# Altium project RTDMeasurement.PrjPcb (part 2 of 2)

## Sheet 12VSupply.SchDoc
size A
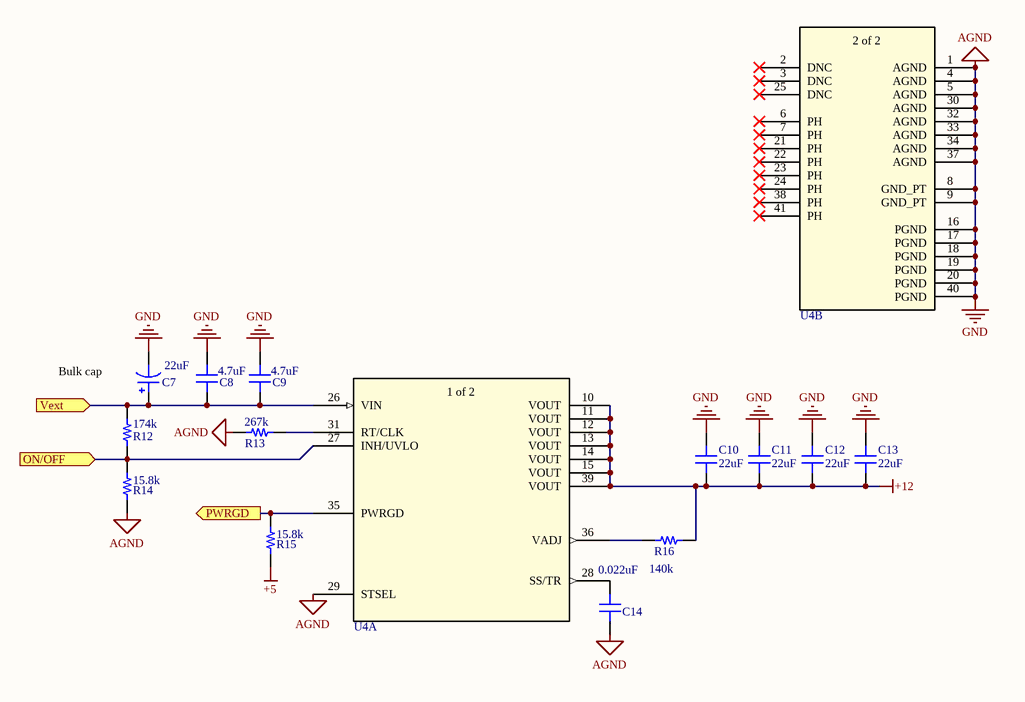
[diagram p9: 12VSupply.SchDoc]

### Parts
C7  22uF  [CAP AL TH D8 L3.5 H11.5]
C8  4.7uF  [CAP 1206/3216 - 1.0MM]
C9  4.7uF  [CAP 1206/3216 - 1.0MM]
C10  22uF  [CAP 1206/3216]
C11  22uF  [CAP 1206/3216]
C12  22uF  [CAP 1206/3216]
C13  22uF  [CAP 1206/3216]
C14  0.022uF  [CAP 0805/2012]
R12  174k  [RES 0805/2012]
R13  267k  [RES 1206/3216]
R14  15.8k  [RES 0805/2012]
R15  15.8k  [RES 0805/2012]
R16  140k  [RES 0805/2012]
U4  LMZ35003RKGR  [RKG41]  (value not drawn)  (parts A,B of 2)

### Ports
ON/OFF (in), PWRGD (out), Vext (in)

### Nets
+5: R15.1
+12: C10.2 C11.2 C12.2 C13.2 R16.2 U4.10(VOUT) U4.11(VOUT) U4.12(VOUT) U4.13(VOUT) U4.14(VOUT) U4.15(VOUT) U4.39(VOUT)
GND: C7.2 C8.2 C9.2 C10.1 C11.1 C12.1 C13.1 C14.1 R13.1 R14.1 U4.1(AGND) U4.4(AGND) U4.5(AGND) U4.8(GND_PT) U4.9(GND_PT) U4.16(PGND) U4.17(PGND) U4.18(PGND) U4.19(PGND) U4.20(PGND) U4.29(STSEL) U4.30(AGND) U4.32(AGND) U4.33(AGND) U4.34(AGND) U4.37(AGND) U4.40(PGND)  [also labelled AGND]
ON/OFF: R12.1 R14.2 U4.27(INH/UVLO) ; port ON/OFF
Vext: C7.1 C8.1 C9.1 R12.2 U4.26(VIN) ; port Vext
NetC14_2: C14.2 U4.28(SS/TR)
NetR13_2: R13.2 U4.31(RT/CLK)
NetR15_2: R15.2 U4.35(PWRGD) ; port PWRGD
NetR16_1: R16.1 U4.36(VADJ)

Not connected (* = marked no-connect by the designer): U4 2(DNC)* 3(DNC)* 6(PH)* 7(PH)* 21(PH)* 22(PH)* 23(PH)* 24(PH)* 25(DNC)* 38(PH)* 41(PH)*

### Notes on the sheet
- Bulk cap
- (in symbol LMZ34003, part A) 1 of 2
- (in symbol LMZ34003, part B) 2 of 2

### Library data of the parts
C7 = EEU-FC2A220: CAP ALUM 22UF 20% 100V RADIAL; Manufacturer: Panasonic Electronic Components; TemperatureRange: -55°C ~ 105°C; Type: Automotive; Ripple Current: 169mA; Lifetime @ Temp: 2000 Hrs @ 105°C; Value: 22uF; Part Number: EEU-FC2A220; PartId: 7484; Supplier 1: Digi-Key; Supplier Part Number 1: P10770-ND; ComponentLink1Description: Datasheet; ComponentLink1URL: https://industrial.panasonic.com/ww/products/capacitors/aluminum-capacitors/aluminum-cap-lead/fc/EEUFC2A220; ComponentLink2Description: Digi-Key listing; ComponentLink2URL: https://www.digikey.com/product-detail/en/panasonic-electronic-components/EEU-FC2A220/P10770-ND/285722; Tolerance: 20%; Voltage: 100V; Price: 0.46; Device Package: Radial, Can - TH
C8 C9 = C3216X5R1H475K085AB: CAP CER 4.7UF 50V X5R 1206; Manufacturer: TDK Corporation; TemperatureRange: -55C ~ 85C; Tolerance: 10%; Value: 4.7uF; Part Number: C3216X5R1H475K085AB; PartId: 17022; Supplier 1: Digi-Key; Supplier Part Number 1: 445-14692-2-ND; ComponentLink1Description: Datasheet; ComponentLink1URL: https://product.tdk.com/info/en/catalog/datasheets/mlcc_commercial_general_en.pdf; ComponentLink2Description: Digi-Key Listing; ComponentLink2URL: https://www.digikey.com/product-detail/en/tdk-corporation/C3216X5R1H475K085AB/445-14692-2-ND/3951928; TemperatureCoefficient: X5R; Voltage: 50V; Price: 0.3159; Device Package: 1206 (3216 Metric)
C10-C13 = CL31A226KAHNNNE: CAP CER 22UF 25V X5R 1206; Manufacturer: Samsung Electro-Mechanics America, Inc.; TemperatureRange: -55C ~ 85C; Tolerance: 10%; Value: 22uF; Part Number: CL31A226KAHNNNE; PartId: 15794; Supplier 1: Digi-Key; Supplier Part Number 1: 1276-3047-2-ND; ComponentLink1Description: Datasheet; ComponentLink1URL: //media.digikey.com/pdf/Data%20Sheets/Samsung%20PDFs/CL31A226KAHNNNE_Spec.pdf; ComponentLink2Description: Digi-Key Listing; ComponentLink2URL: https://www.digikey.com/product-detail/en/samsung-electro-mechanics-america-inc/CL31A226KAHNNNE/1276-3047-2-ND/3888705; TemperatureCoefficient: X5R; Voltage: 25V; Price: 0.1785; Device Package: 1206 (3216 Metric)
C14 = C0805S223K1RAC7800: CAP CER 0.022UF 100V X7R 0805; Manufacturer: Kemet; TemperatureRange: -55C ~ 125C; Tolerance: 10%; Value: 0.022uF; Part Number: C0805S223K1RAC7800; PartId: 14304; Supplier 1: Digi-Key; Supplier Part Number 1: 399-13176-2-ND; ComponentLink1Description: Datasheet; ComponentLink1URL: http://www.kemet.com/docfinder?Partnumber=C0805S223K1RACTU; ComponentLink2Description: Digi-Key Listing; ComponentLink2URL: https://www.digikey.com/product-detail/en/kemet/C0805S223K1RAC7800/399-13176-2-ND/2213362; TemperatureCoefficient: X7R; Voltage: 100V; Price: 0.071; Device Package: 0805 (2012 Metric)
R12 = ERJ-6ENF1743V: RES SMD 174K OHM 1% 1/8W 0805; Manufacturer: Panasonic Electronic Components; TemperatureRange: -55C ~ 155C; TemperatureCoefficient: 100ppm/C; PowerRating: 0.125W, 1/8W; Value: 174k; Part Number: ERJ-6ENF1743V; PartId: 2344; Supplier 1: Digi-Key; Supplier Part Number 1: P174KCTR-ND; ComponentLink1Description: Datasheet; ComponentLink1URL: http://industrial.panasonic.com/www-cgi/jvcr13pz.cgi?E+PZ+3+AOA0002+ERJ6ENF1743V+7+WW; ComponentLink2Description: Digi-Key listing; ComponentLink2URL: http://digikey.com/product-detail/en/ERJ-6ENF1743V/P174KCTR-ND/111921; Tolerance: 1%; Price: 0.0073; Type: Thick Film; Device Package: 0805 (2012 Metric)
R13 = ERJ-8ENF2673V: RES SMD 267K OHM 1% 1/4W 1206; Manufacturer: Panasonic Electronic Components; TemperatureRange: -55C ~ 155C; TemperatureCoefficient: 100ppm/C; PowerRating: 0.25W, 1/4W; Value: 267k; Part Number: ERJ-8ENF2673V; PartId: 3280; Supplier 1: Digi-Key; Supplier Part Number 1: P267KFTR-ND; ComponentLink1Description: Datasheet; ComponentLink1URL: http://industrial.panasonic.com/www-cgi/jvcr13pz.cgi?E+PZ+3+AOA0002+ERJ8ENF2673V+7+WW; ComponentLink2Description: Digi-Key listing; ComponentLink2URL: http://digikey.com/product-detail/en/ERJ-8ENF2673V/P267KFTR-ND/89429; Tolerance: 1%; Price: 0.0093; Type: Thick Film; Device Package: 1206 (3216 Metric)
R14 R15 = ERJ-6ENF1582V: RES SMD 15.8K OHM 1% 1/8W 0805; Manufacturer: Panasonic Electronic Components; TemperatureRange: -55C ~ 155C; TemperatureCoefficient: 100ppm/C; PowerRating: 0.125W, 1/8W; Value: 15.8k; Part Number: ERJ-6ENF1582V; PartId: 2101; Supplier 1: Digi-Key; Supplier Part Number 1: P15.8KCTR-ND; ComponentLink1Description: Datasheet; ComponentLink1URL: http://industrial.panasonic.com/www-cgi/jvcr13pz.cgi?E+PZ+3+AOA0002+ERJ6ENF1582V+7+WW; ComponentLink2Description: Digi-Key listing; ComponentLink2URL: http://digikey.com/product-detail/en/ERJ-6ENF1582V/P15.8KCTR-ND/6419; Tolerance: 1%; Price: 0.0073; Type: Thick Film; Device Package: 0805 (2012 Metric)
R16 = ERJ-6ENF1403V: RES SMD 140K OHM 1% 1/8W 0805; Manufacturer: Panasonic Electronic Components; TemperatureRange: -55C ~ 155C; TemperatureCoefficient: 100ppm/C; PowerRating: 0.125W, 1/8W; Value: 140k; Part Number: ERJ-6ENF1403V; PartId: 2209; Supplier 1: Digi-Key; Supplier Part Number 1: P140KCTR-ND; ComponentLink1Description: Datasheet; ComponentLink1URL: http://industrial.panasonic.com/www-cgi/jvcr13pz.cgi?E+PZ+3+AOA0002+ERJ6ENF1403V+7+WW; ComponentLink2Description: Digi-Key listing; ComponentLink2URL: http://digikey.com/product-detail/en/ERJ-6ENF1403V/P140KCTR-ND/111888; Tolerance: 1%; Price: 0.0073; Type: Thick Film; Device Package: 0805 (2012 Metric)
U4 = LMZ34003: DC DC CONVERTER 2.5-15V 38W; Manufacturer_Part_Number: LMZ34002RKGT; Vendor: Texas Instruments; Built_By: EMA_UL_Team; Output Configuration: Positive; Topology: Buck, Buck-Boost; Output Type: Adjustable; Number Of Outputs: 1; Voltage - Input (Min): 7V; Voltage - Input (Max): 50V; Voltage - Output (Min/Fixed): 2.5V; Voltage - Output (Max): 15V; Current Output: 2.5A; Frequency - Switching: 800kHz; Synchronous Rectifier: No; Copyright: Copyright (C) 2018 Accelerated Designs. All rights reserved; RefDes: RefDes; Type: Non-Isolated PoL Module; Value: Value; Part Number: LMZ34003; PartId: 16768; Manufacturer: Texas Instruments; Supplier 1: Digi-Key; Supplier Part Number 1: 296-43647-1-ND; ComponentLink1Description: Datasheet; ComponentLink1URL: http://www.ti.com/lit/ds/symlink/lmz35003.pdf; ComponentLink2Description: Digi-Key Listing; ComponentLink2URL: https://www.digikey.com/product-detail/en/texas-instruments/LMZ35003RKGR/296-43647-1-ND/5864851; Device Package: 41-B1QFN (11x9); Price: 11.89; Series: SIMPLE SWITCHER®; Operating Temperature: -40°C ~ 85°C

## Sheet 5VSupply.SchDoc
size A
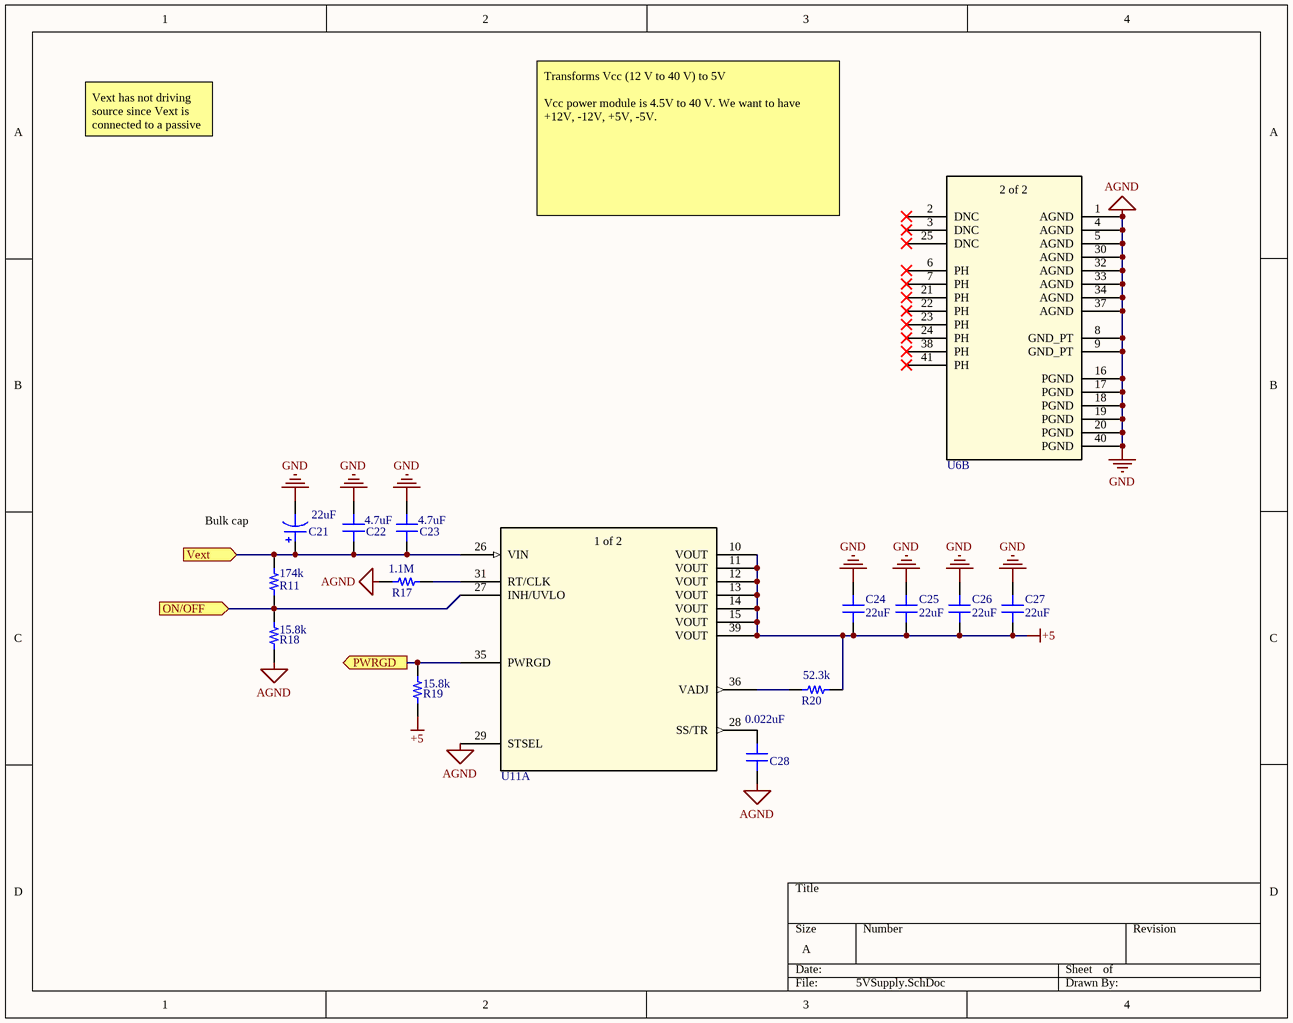
[diagram p10: 5VSupply.SchDoc]

### Parts
C21  22uF  [CAP AL TH D8 L3.5 H11.5]
C22  4.7uF  [CAP 1206/3216 - 1.0MM]
C23  4.7uF  [CAP 1206/3216 - 1.0MM]
C24  22uF  [CAP 1206/3216]
C25  22uF  [CAP 1206/3216]
C26  22uF  [CAP 1206/3216]
C27  22uF  [CAP 1206/3216]
C28  0.022uF  [CAP 0805/2012]
R11  174k  [RES 0805/2012]
R17  1.1M  [RES 0603/1608]
R18  15.8k  [RES 0805/2012]
R19  15.8k  [RES 0805/2012]
R20  52.3k  [RES 0603/1608]
U6  LMZ34003  [RKG41]  (value not drawn)  (part B of 2)
U11  LMZ35003RKGR  [RKG41]  (value not drawn)  (part A of 2)

### Ports
ON/OFF (in), PWRGD (out), Vext (in)

### Nets
+5: C24.2 C25.2 C26.2 C27.2 R19.1 R20.2 U11.10(VOUT) U11.11(VOUT) U11.12(VOUT) U11.13(VOUT) U11.14(VOUT) U11.15(VOUT) U11.39(VOUT)
GND: C21.2 C22.2 C23.2 C24.1 C25.1 C26.1 C27.1 C28.1 R17.1 R18.1 U6.1(AGND) U6.4(AGND) U6.5(AGND) U6.8(GND_PT) U6.9(GND_PT) U6.16(PGND) U6.17(PGND) U6.18(PGND) U6.19(PGND) U6.20(PGND) U6.30(AGND) U6.32(AGND) U6.33(AGND) U6.34(AGND) U6.37(AGND) U6.40(PGND) U11.29(STSEL)  [also labelled AGND]
ON/OFF: R11.1 R18.2 U11.27(INH/UVLO) ; port ON/OFF
Vext: C21.1 C22.1 C23.1 R11.2 U11.26(VIN) ; port Vext
NetC28_2: C28.2 U11.28(SS/TR)
NetR17_2: R17.2 U11.31(RT/CLK)
NetR19_2: R19.2 U11.35(PWRGD) ; port PWRGD
NetR20_1: R20.1 U11.36(VADJ)

Not connected (* = marked no-connect by the designer): U6 2(DNC)* 3(DNC)* 6(PH)* 7(PH)* 21(PH)* 22(PH)* 23(PH)* 24(PH)* 25(DNC)* 38(PH)* 41(PH)*

### Notes on the sheet
- Vext has not driving source since Vext is connected to a passive connector. The connector is the driving source.
- Transforms Vcc (12 V to 40 V) to 5V
  Vcc power module is 4.5V to 40 V. We want to have +12V, -12V, +5V, -5V.
- Bulk cap
- (in symbol LMZ34003, part A) 1 of 2
- (in symbol LMZ34003, part B) 2 of 2

### Library data of the parts
C21 = EEU-FC2A220: as C7 on sheet 12VSupply; Value: 22uF; Part Number: EEU-FC2A220; PartId: 7484; Supplier 1: Digi-Key; Supplier Part Number 1: P10770-ND; ComponentLink1Description: Datasheet; ComponentLink1URL: https://industrial.panasonic.com/ww/products/capacitors/aluminum-capacitors/aluminum-cap-lead/fc/EEUFC2A220; ComponentLink2Description: Digi-Key listing; ComponentLink2URL: https://www.digikey.com/product-detail/en/panasonic-electronic-components/EEU-FC2A220/P10770-ND/285722; Tolerance: 20%; Voltage: 100V; Price: 0.46; Device Package: Radial, Can - TH
C22 C23 = C3216X5R1H475K085AB: as C8 on sheet 12VSupply; Value: 4.7uF; Part Number: C3216X5R1H475K085AB; PartId: 17022; Supplier 1: Digi-Key; Supplier Part Number 1: 445-14692-2-ND; ComponentLink1Description: Datasheet; ComponentLink1URL: https://product.tdk.com/info/en/catalog/datasheets/mlcc_commercial_general_en.pdf; ComponentLink2Description: Digi-Key Listing; ComponentLink2URL: https://www.digikey.com/product-detail/en/tdk-corporation/C3216X5R1H475K085AB/445-14692-2-ND/3951928; TemperatureCoefficient: X5R; Voltage: 50V; Price: 0.3159; Device Package: 1206 (3216 Metric)
C24-C27 = CL31A226KAHNNNE: as C10 on sheet 12VSupply; Value: 22uF; Part Number: CL31A226KAHNNNE; PartId: 15794; Supplier 1: Digi-Key; Supplier Part Number 1: 1276-3047-2-ND; ComponentLink1Description: Datasheet; ComponentLink1URL: //media.digikey.com/pdf/Data%20Sheets/Samsung%20PDFs/CL31A226KAHNNNE_Spec.pdf; ComponentLink2Description: Digi-Key Listing; ComponentLink2URL: https://www.digikey.com/product-detail/en/samsung-electro-mechanics-america-inc/CL31A226KAHNNNE/1276-3047-2-ND/3888705; TemperatureCoefficient: X5R; Voltage: 25V; Price: 0.1785; Device Package: 1206 (3216 Metric)
C28 = C0805S223K1RAC7800: as C14 on sheet 12VSupply; Value: 0.022uF; Part Number: C0805S223K1RAC7800; PartId: 14304; Supplier 1: Digi-Key; Supplier Part Number 1: 399-13176-2-ND; ComponentLink1Description: Datasheet; ComponentLink1URL: http://www.kemet.com/docfinder?Partnumber=C0805S223K1RACTU; ComponentLink2Description: Digi-Key Listing; ComponentLink2URL: https://www.digikey.com/product-detail/en/kemet/C0805S223K1RAC7800/399-13176-2-ND/2213362; TemperatureCoefficient: X7R; Voltage: 100V; Price: 0.071; Device Package: 0805 (2012 Metric)
R11 = ERJ-6ENF1743V: as R12 on sheet 12VSupply; Value: 174k; Part Number: ERJ-6ENF1743V; PartId: 2344; Supplier 1: Digi-Key; Supplier Part Number 1: P174KCTR-ND; ComponentLink1Description: Datasheet; ComponentLink1URL: http://industrial.panasonic.com/www-cgi/jvcr13pz.cgi?E+PZ+3+AOA0002+ERJ6ENF1743V+7+WW; ComponentLink2Description: Digi-Key listing; ComponentLink2URL: http://digikey.com/product-detail/en/ERJ-6ENF1743V/P174KCTR-ND/111921; Tolerance: 1%; Price: 0.0073; Type: Thick Film; Device Package: 0805 (2012 Metric)
R17 = ERJ-3EKF1104V: RES SMD 1.1M OHM 1% 1/10W 0603; Manufacturer: Panasonic Electronic Components; TemperatureRange: -55C ~ 155C; TemperatureCoefficient: 100ppm/C; PowerRating: 0.1W, 1/10W; Value: 1.1M; Part Number: ERJ-3EKF1104V; PartId: 1352; Supplier 1: Digi-Key; Supplier Part Number 1: P1.10MHTR-ND; ComponentLink1Description: Datasheet; ComponentLink1URL: http://industrial.panasonic.com/www-cgi/jvcr17pz.cgi?E+PZ+3+AOA0002+ERJ3EKF1101V+WW; ComponentLink2Description: Digi-Key listing; ComponentLink2URL: http://digikey.com/product-detail/en/ERJ-3EKF1104V/P1.10MHTR-ND/282702; Tolerance: 1%; Price: 0.0038; Type: Thick Film; Device Package: 0603 (1608 Metric)
R18 R19 = ERJ-6ENF1582V: as R14 on sheet 12VSupply; Value: 15.8k; Part Number: ERJ-6ENF1582V; PartId: 2101; Supplier 1: Digi-Key; Supplier Part Number 1: P15.8KCTR-ND; ComponentLink1Description: Datasheet; ComponentLink1URL: http://industrial.panasonic.com/www-cgi/jvcr13pz.cgi?E+PZ+3+AOA0002+ERJ6ENF1582V+7+WW; ComponentLink2Description: Digi-Key listing; ComponentLink2URL: http://digikey.com/product-detail/en/ERJ-6ENF1582V/P15.8KCTR-ND/6419; Tolerance: 1%; Price: 0.0073; Type: Thick Film; Device Package: 0805 (2012 Metric)
R20 = ERA-3AEB5232V: RES SMD 52.3KOHM 0.1% 1/10W 0603; Manufacturer: Panasonic Electronic Components; TemperatureRange: -55C ~ 155C; TemperatureCoefficient: 25ppm/C; PowerRating: 0.1W, 1/10W; Value: 52.3k; Part Number: ERA-3AEB5232V; PartId: 1573; Supplier 1: Digi-Key; Supplier Part Number 1: P52.3KDBTR-ND; ComponentLink1Description: Datasheet; ComponentLink1URL: http://industrial.panasonic.com/lecs/www-data/pdf/AOA0000/AOA0000CE26.pdf; ComponentLink2Description: Digi-Key listing; ComponentLink2URL: http://digikey.com/product-detail/en/ERA-3AEB5232V/P52.3KDBTR-ND/2026903; Tolerance: 0.1%; Price: 0.0653; Type: Thin Film; Device Package: 0603 (1608 Metric)
U6 U11 = LMZ34003: as U4 on sheet 12VSupply; Copyright: Copyright (C) 2018 Accelerated Designs. All rights reserved; RefDes: RefDes; Type: Non-Isolated PoL Module; Value: Value; Part Number: LMZ34003; PartId: 16768; Manufacturer: Texas Instruments; Supplier 1: Digi-Key; Supplier Part Number 1: 296-43647-1-ND; ComponentLink1Description: Datasheet; ComponentLink1URL: http://www.ti.com/lit/ds/symlink/lmz35003.pdf; ComponentLink2Description: Digi-Key Listing; ComponentLink2URL: https://www.digikey.com/product-detail/en/texas-instruments/LMZ35003RKGR/296-43647-1-ND/5864851; Device Package: 41-B1QFN (11x9); Price: 11.89; Series: SIMPLE SWITCHER®; Operating Temperature: -40°C ~ 85°C

## Sheet PowerIsolation.SchDoc
size A
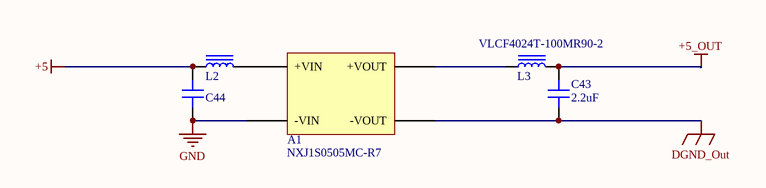
[diagram p11: PowerIsolation.SchDoc]

### Parts
A1  NXJ1S0505MC-R7  [MURATA NXJ1]
C43  2.2uF  [CAP 1206/3216]
C44  4.7uF  [CAP 1206/3216 - 1.8MM]  (value not drawn)
L2  VLCF4024T-4R7N1R4-2  [TDK VLCF4024-2]  (value not drawn)
L3  VLCF4024T-100MR90-2  [TDK VLCF4024-2]

### Nets
+5: C44.2 L2.1
+5_OUT: C43.1 L3.2
DGND_Out: A1.7(-VOUT) C43.2
GND: A1.1(-VIN) C44.1
NetA1_3: A1.3(+VIN) L2.2
NetA1_8: A1.8(+VOUT) L3.1

### Library data of the parts
A1 = NXJ1S0505MC-R7: DC/DC SM 1W 5V-5V SINGLE 4.2KV; Manufacturer: Murata Power Solutions Inc.; Number Of Outputs: 1; Voltage - Input (Min): 4.5V; Voltage - Input (Max): 5.5V; Voltage - Output 1: 5V; Current - Output (Max): 200mA; Voltage - Isolation: 4.2kV (4200V); Part Number: NXJ1S0505MC-R7; PartId: 14964; Supplier 1: Digi-Key; Supplier Part Number 1: 811-3094-1-ND; ComponentLink1Description: Datasheet; ComponentLink1URL: http://power.murata.com/data/power/ncl/kdc_nxj1.pdf; ComponentLink2Description: Digi-Key Listing; ComponentLink2URL: https://www.digikey.com/product-detail/en/murata-power-solutions-inc/NXJ1S0505MC-R7/811-3094-1-ND/5697921; Price: 3.55; Type: Isolated Module; Device Package: 14-SMD Module (5 Leads); Operating Temperature: -40C ~ 85C; Power (Watts): 1W
C43 = CL31B225KCHSNNE: CAP CER 2.2UF 100V X7R 1206; Manufacturer: Samsung Electro-Mechanics America, Inc.; TemperatureRange: -55C ~ 125C; Tolerance: 10%; Value: 2.2uF; Part Number: CL31B225KCHSNNE; PartId: 6260; Supplier 1: Digi-Key; Supplier Part Number 1: 1276-3138-2-ND; ComponentLink1Description: Datasheet; ComponentLink1URL: http://media.digikey.com/pdf/Data%20Sheets/Samsung%20PDFs/CL31B225KCHSNNE_Spec.pdf; ComponentLink2Description: Digi-Key listing; ComponentLink2URL: http://digikey.com/product-detail/en/CL31B225KCHSNNE/1276-3138-2-ND/3888796; TemperatureCoefficient: X7R; Voltage: 100V; Price: 0.3227; Type: -; Device Package: 1206 (3216 Metric)
C44 = CL31B475KPHNNNE: CAP CER 4.7UF 10V X7R 1206; Manufacturer: Samsung Electro-Mechanics America, Inc.; TemperatureRange: -55C ~ 125C; Tolerance: 10%; Value: 4.7uF; Part Number: CL31B475KPHNNNE; PartId: 17410; Supplier 1: Digi-Key; Supplier Part Number 1: 1276-1133-2-ND; ComponentLink1Description: Datasheet; ComponentLink1URL: http://www.samsungsem.com/kr/front/downloadcms.do?path=/kr/support/product-search/mlcc/__icsFiles/afieldfile/2014/11/05&fileName=C_CL31B475KPHNNNE.pdf; ComponentLink2Description: Digi-Key Listing; ComponentLink2URL: https://www.digikey.com/product-detail/en/samsung-electro-mechanics-america-inc/CL31B475KPHNNNE/1276-1133-2-ND/3886791; TemperatureCoefficient: X7R; Voltage: 10V; Price: 0.0761; Device Package: 1206 (3216 Metric)
L2 = VLCF4024T-4R7N1R4-2: FIXED IND 4.7UH 1.43A 87 MOHM; Manufacturer: TDK Corporation; Type: Wirewound; Material - Core: Ferrite; Tolerance: 30%; Shielding: Shielded; DC Resistance (DCR): 87 mOhm Max; Value: 4.7uH; Part Number: VLCF4024T-4R7N1R4-2; PartId: 16432; Supplier 1: Digi-Key; Supplier Part Number 1: 445-8737-2-ND; ComponentLink1Description: Datasheet; ComponentLink1URL: https://product.tdk.com/info/en/catalog/datasheets/inductor_commercial_power_vlcf4024-2_en.pdf; ComponentLink2Description: Digi-Key Listing; ComponentLink2URL: https://www.digikey.com/product-detail/en/tdk-corporation/VLCF4024T-4R7N1R4-2/445-8737-2-ND/3083279; Price: 0.441; Device Package: Nonstandard; Series: VLCF; Inductance: 4.7uH; Current Rating: 1.43A; Current - Saturation: 1.43A; Operating Temperature: -40C ~ 105C
L3 = VLCF4024T-100MR90-2: FIXED IND 10UH 900MA 136 MOHM; Manufacturer: TDK Corporation; Type: Wirewound; Material - Core: Ferrite; Tolerance: 20%; Shielding: Shielded; DC Resistance (DCR): 136 mOhm Max; Value: 10uH; Part Number: VLCF4024T-100MR90-2; PartId: 16429; Supplier 1: Digi-Key; Supplier Part Number 1: 445-8727-2-ND; ComponentLink1Description: Datasheet; ComponentLink1URL: https://product.tdk.com/info/en/catalog/datasheets/inductor_commercial_power_vlcf4024-2_en.pdf; ComponentLink2Description: Digi-Key Listing; ComponentLink2URL: https://www.digikey.com/product-detail/en/tdk-corporation/VLCF4024T-100MR90-2/445-8727-2-ND/3083281; Price: 0.441; Device Package: Nonstandard; Series: VLCF; Inductance: 10uH; Current Rating: 900mA; Current - Saturation: 900mA; Operating Temperature: -40C ~ 105C

## Sheet MonitorOut.SchDoc
size A
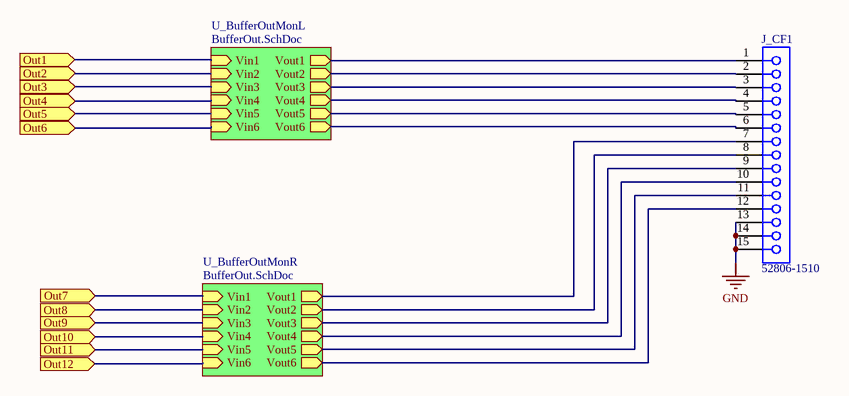
[diagram p12: MonitorOut.SchDoc]

### Parts
J_CF1  52806-1510  [MOLX-52806-1510]

### Sub-sheets
U_BufferOutMonL = BufferOut.SchDoc: Vin1 (in), Vout1 (out), Vin2 (in), Vout2 (out), Vin3 (in), Vout3 (out), Vin4 (in), Vout4 (out), Vin5 (in), Vout5 (out), Vin6 (in), Vout6 (out)
U_BufferOutMonR = BufferOut.SchDoc: Vin1 (in), Vout1 (out), Vin2 (in), Vout2 (out), Vin3 (in), Vout3 (out), Vin4 (in), Vout4 (out), Vin5 (in), Vout5 (out), Vin6 (in), Vout6 (out)

### Ports
Out1 (in), Out2 (in), Out3 (in), Out4 (in), Out5 (in), Out6 (in), Out7 (in), Out8 (in), Out9 (in), Out10 (in), Out11 (in), Out12 (in)

### Nets
GND: J_CF1.13 J_CF1.14 J_CF1.15
Vrtd1: port Out1, sheet U_BufferOutMonL/Vin1
Vrtd2: port Out2, sheet U_BufferOutMonL/Vin2
Vrtd3: port Out3, sheet U_BufferOutMonL/Vin3
Vrtd4: port Out4, sheet U_BufferOutMonL/Vin4
Vrtd5: port Out5, sheet U_BufferOutMonL/Vin5
Vrtd6: port Out6, sheet U_BufferOutMonL/Vin6
Vrtd7: port Out7, sheet U_BufferOutMonR/Vin1
Vrtd8: port Out8, sheet U_BufferOutMonR/Vin2
Vrtd9: port Out9, sheet U_BufferOutMonR/Vin3
Vrtd10: port Out10, sheet U_BufferOutMonR/Vin4
Vrtd11: port Out11, sheet U_BufferOutMonR/Vin5
Vrtd12: port Out12, sheet U_BufferOutMonR/Vin6
NetJ_CF1_1: J_CF1.1 ; sheet U_BufferOutMonL/Vout1
NetJ_CF1_2: J_CF1.2 ; sheet U_BufferOutMonL/Vout2
NetJ_CF1_3: J_CF1.3 ; sheet U_BufferOutMonL/Vout3
NetJ_CF1_4: J_CF1.4 ; sheet U_BufferOutMonL/Vout4
NetJ_CF1_5: J_CF1.5 ; sheet U_BufferOutMonL/Vout5
NetJ_CF1_6: J_CF1.6 ; sheet U_BufferOutMonL/Vout6
NetJ_CF1_7: J_CF1.7 ; sheet U_BufferOutMonR/Vout1
NetJ_CF1_8: J_CF1.8 ; sheet U_BufferOutMonR/Vout2
NetJ_CF1_9: J_CF1.9 ; sheet U_BufferOutMonR/Vout3
NetJ_CF1_10: J_CF1.10 ; sheet U_BufferOutMonR/Vout4
NetJ_CF1_11: J_CF1.11 ; sheet U_BufferOutMonR/Vout5
NetJ_CF1_12: J_CF1.12 ; sheet U_BufferOutMonR/Vout6

### Library data of the parts
J_CF1 = CMP-1242-00172-1: 1.0 mm Pitch FFC Connector, 5.4 mm Mated Height, Vertical, Non-ZIF, Through Hole, 15 Circuits, -20 to 80 degC, ELV and RoHS Compliant, Tray; Manufacturer: Molex; Voltage (Max): 50V AC (RMS)/DC; Pitch - Mating Interface: 1.00mm; Circuits (maximum): 15; Durability (mating cycles max): 10; Stackable: No; Current (Max per Contact): 0.5A; Mated Height: 5.40mm; Material - Plating Mating: Tin; PCB Retention: None; Material - Metal: Phosphor Bronze; ComponentLink3URL: http://www.molex.com/pdm_docs/sd/528061510_sd.pdf; PartNumber: 52806-1510; ComponentLink2URL: http://www.molex.com/webdocs/datasheets/pdf/en-us/0528061510_FFC_FPC_CONNECTORS.pdf; PackageVersion: Rev. B, 08/2002; Pitch - Termination Interface: 1.00mm; Circuits (Loaded): 15; PackageDescription: 15-Lead FFC Connector, Pitch 1.0 mm; ComponentLink1URL: http://www.molex.com/molex/index.jsp; Packing: Tray; ComponentLink1Description: Manufacturer URL; Entry Angle: Vertical; Contact Position: N/A; PCB Locator: No; Number of Rows: 1; ComponentLink2Description: Datasheet; Material - Plating Termination: Tin; Orientation: Vertical; RoHS: TRUE; PackageReference: 52806-1510; ComponentLink3Description: Package Specification; Mounting Technology: Through Hole; Polarized to PCB: No

## Sheet BufferOut.SchDoc
size A
Used 4 times, as channels U_MonitorOut/U_BufferOutMonL, U_MonitorOut/U_BufferOutMonR, U_BufferOutR, U_BufferOutL. Parts and nets are listed once, with the designators drawn on the sheet.
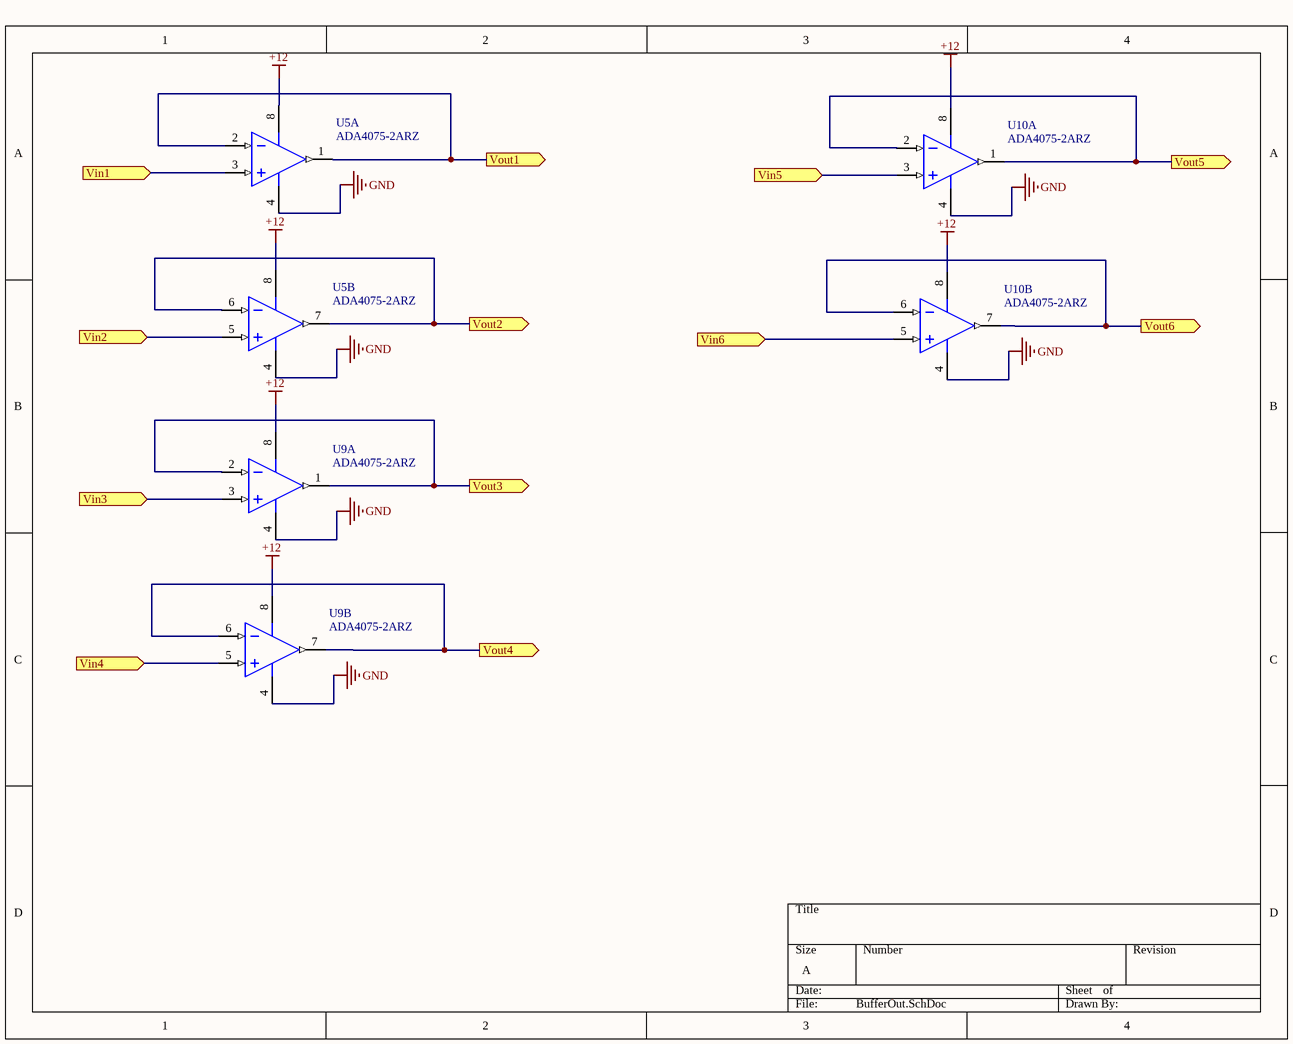
[diagram p13: BufferOut.SchDoc]

### Parts
U5  ADA4075-2ARZ  [ADI-R-8_N]  (parts A,B of 2)
U9  ADA4075-2ARZ  [ADI-R-8_N]  (parts A,B of 2)
U10  ADA4075-2ARZ  [ADI-R-8_N]  (parts A,B of 2)

### Ports
Vin1 (in), Vin2 (in), Vin3 (in), Vin4 (in), Vin5 (in), Vin6 (in), Vout1 (out), Vout2 (out), Vout3 (out), Vout4 (out), Vout5 (out), Vout6 (out)

### Nets
+12: U5.8(+V) U9.8(+V) U10.8(+V)
GND: U5.4(-V) U9.4(-V) U10.4(-V)
Vin1: U5.3(+IN_A) ; port Vin1
Vin2: U5.5(+IN_B) ; port Vin2
Vin3: U9.3(+IN_A) ; port Vin3
Vin4: U9.5(+IN_B) ; port Vin4
Vin5: U10.3(+IN_A) ; port Vin5
Vin6: U10.5(+IN_B) ; port Vin6
Vout1: U5.1(OUT_A) U5.2(-IN_A) ; port Vout1
Vout2: U5.6(-IN_B) U5.7(OUT_B) ; port Vout2
Vout3: U9.1(OUT_A) U9.2(-IN_A) ; port Vout3
Vout4: U9.6(-IN_B) U9.7(OUT_B) ; port Vout4
Vout5: U10.1(OUT_A) U10.2(-IN_A) ; port Vout5
Vout6: U10.6(-IN_B) U10.7(OUT_B) ; port Vout6

### Channels
U_MonitorOut/U_BufferOutMonL: designators end in A; ports Vin1=Vrtd1 Vin2=Vrtd2 Vin3=Vrtd3 Vin4=Vrtd4 Vin5=Vrtd5 Vin6=Vrtd6 Vout1=NetJ_CF1_1 Vout2=NetJ_CF1_2 Vout3=NetJ_CF1_3 Vout4=NetJ_CF1_4 Vout5=NetJ_CF1_5 Vout6=NetJ_CF1_6
U_MonitorOut/U_BufferOutMonR: designators end in B; ports Vin1=Vrtd7 Vin2=Vrtd8 Vin3=Vrtd9 Vin4=Vrtd10 Vin5=Vrtd11 Vin6=Vrtd12 Vout1=NetJ_CF1_7 Vout2=NetJ_CF1_8 Vout3=NetJ_CF1_9 Vout4=NetJ_CF1_10 Vout5=NetJ_CF1_11 Vout6=NetJ_CF1_12
U_BufferOutR: designators end in C; ports Vin1=Vthr7 Vin2=Vthr8 Vin3=Vthr9 Vin4=Vthr10 Vin5=Vthr11 Vin6=Vthr12 Vout1=NetJ_VTH_7 Vout2=NetJ_VTH_8 Vout3=NetJ_VTH_9 Vout4=NetJ_VTH_10 Vout5=NetJ_VTH_11 Vout6=NetJ_VTH_12
U_BufferOutL: designators end in D; ports Vin1=Vthr1 Vin2=Vthr2 Vin3=Vthr3 Vin4=Vthr4 Vin5=Vthr5 Vin6=Vthr6 Vout1=NetJ_VTH_1 Vout2=NetJ_VTH_2 Vout3=NetJ_VTH_3 Vout4=NetJ_VTH_4 Vout5=NetJ_VTH_5 Vout6=NetJ_VTH_6

### Library data of the parts
U5 U9 U10 = CMP-0384-00855-1: Double Channel Ultra Low Noise Operational Amplifier, 6.5 MHz BW, 12 V/us SR, Industrial, 8-pin SOIC (R-8), Tube; Manufacturer: Analog Devices; V Span Max: 36V; Small Signal Bandwidth: 6.5MHz; Input Bias Current: 30nA; V Span Min: 24V; Amplifiers Per Package: 2; Input Offset Voltage: 300uV; Slew Rate: 12V/us; Iq/Amp: 1.8mA; DatasheetVersion: Rev. B; PackageDescription: 8-Pin Standard Small Outline Package, Body 3.9 x 4.9 mm, Pitch 1.27 mm; Generic Part Number: ADA4075-2; PackageReference: R-8; ComponentLink3URL: http://www.analog.com/static/imported-files/packages/PKG_PDF/SOIC_Narrow%20(R)/R_8.pdf; ComponentLink2URL: http://www.analog.com/static/imported-files/data_sheets/ADA4075-2.pdf; ComponentLink3Description: Package Specification; ComponentLink1Description: Manufacturer URL; PartNumber: ADA4075-2ARZ; PackageVersion: 060506-A; ComponentLink2Description: Datasheet; Code_JEDEC: MS-012-AA; ComponentLink1URL: http://www.analog.com/en/index.html; Mounting Technology: Surface Mount

## Nets that join several sheets
+5: U_ConnectorSch1 (J1A.4), U_ConnectorSch2 (J1B.4), U_ConnectorSch3 (J1C.4), U_ConnectorSch4 (J1D.4), U_ConnectorSch5 (J1E.4), U_ConnectorSch6 (J1F.4), U_ComparisonSch1 (R8A.2), U_ComparisonSch2 (R8B.2), U_ComparisonSch3 (R8C.2), U_ComparisonSch4 (R8D.2), U_ComparisonSch5 (R8E.2), U_ComparisonSch6 (R8F.2), U_ComparisonSch7 (R8G.2), U_ComparisonSch8 (R8H.2), U_ComparisonSch9 (R8I.2), U_ComparisonSch10 (R8J.2), U_ComparisonSch11 (R8K.2), U_ComparisonSch12 (R8L.2), U_IsolationOut (6 pins), PowerDelivery (ON/OFF1.3 POW_2.1), 12VSupply (R15.1), 5VSupply (13 pins), PowerIsolation (C44.2 L2.1), U_ConnectorSch7 (J1G.4), U_ConnectorSch8 (J1H.4), U_ConnectorSch9 (J1I.4), U_ConnectorSch10 (J1J.4), U_ConnectorSch11 (J1K.4), U_ConnectorSch12 (J1L.4), U_ConnGd (6 pins)
+5_OUT: U_IsolationOut (9 pins), PowerIsolation (C43.1 L3.2), U_ConnGd (9 pins)
+12: U_RTDAnalog1 (C1A.1 U1A.8), U_RTDAnalog2 (C1B.1 U1B.8), U_RTDAnalog3 (C1C.1 U1C.8), U_RTDAnalog4 (C1D.1 U1D.8), U_RTDAnalog5 (C1E.1 U1E.8), U_RTDAnalog6 (C1F.1 U1F.8), U_VrefSch1 (C3A.2 U2A.2), U_VrefSch2 (C3B.2 U2B.2), U_VrefSch3 (C3C.2 U2C.2), U_RTDAnalog7 (C1G.1 U1G.8), U_RTDAnalog8 (C1H.1 U1H.8), U_RTDAnalog9 (C1I.1 U1I.8), U_RTDAnalog10 (C1J.1 U1J.8), U_RTDAnalog11 (C1K.1 U1K.8), U_RTDAnalog12 (C1L.1 U1L.8), U_ComparisonSch1 (C6A.1 U3A.8), U_ComparisonSch2 (C6B.1 U3B.8), U_ComparisonSch3 (C6C.1 U3C.8), U_ComparisonSch4 (C6D.1 U3D.8), U_ComparisonSch5 (C6E.1 U3E.8), U_ComparisonSch6 (C6F.1 U3F.8), U_ComparisonSch7 (C6G.1 U3G.8), U_ComparisonSch8 (C6H.1 U3H.8), U_ComparisonSch9 (C6I.1 U3I.8), U_ComparisonSch10 (C6J.1 U3J.8), U_ComparisonSch11 (C6K.1 U3K.8), U_ComparisonSch12 (C6L.1 U3L.8), PowerDelivery (POW_1.1), 12VSupply (12 pins), U_MonitorOut/U_BufferOutMonL (U5A.8 U9A.8 U10A.8), U_MonitorOut/U_BufferOutMonR (U5B.8 U9B.8 U10B.8), U_BufferOutR (U5C.8 U9C.8 U10C.8), U_BufferOutL (U5D.8 U9D.8 U10D.8)
-12: U_RTDAnalog1 (C2A.2 U1A.5), U_RTDAnalog2 (C2B.2 U1B.5), U_RTDAnalog3 (C2C.2 U1C.5), U_RTDAnalog4 (C2D.2 U1D.5), U_RTDAnalog5 (C2E.2 U1E.5), U_RTDAnalog6 (C2F.2 U1F.5), U_RTDAnalog7 (C2G.2 U1G.5), U_RTDAnalog8 (C2H.2 U1H.5), U_RTDAnalog9 (C2I.2 U1I.5), U_RTDAnalog10 (C2J.2 U1J.5), U_RTDAnalog11 (C2K.2 U1K.5), U_RTDAnalog12 (C2L.2 U1L.5), PowerDelivery (POW_1.3), Neg12V (24 pins)
DGND_Out: U_IsolationOut (12 pins), PowerIsolation (A1.7 C43.2), U_ConnGd (12 pins)
GND: MainSch (J_VTH.13 J_VTH.14 J_VTH.15), U_RTDAnalog1 (C1A.2 C2A.1 U1A.6), U_RTDAnalog2 (C1B.2 C2B.1 U1B.6), U_RTDAnalog3 (C1C.2 C2C.1 U1C.6), U_RTDAnalog4 (C1D.2 C2D.1 U1D.6), U_RTDAnalog5 (C1E.2 C2E.1 U1E.6), U_RTDAnalog6 (C1F.2 C2F.1 U1F.6), U_VrefSch1 (C3A.1 C4A.1 C5A.1 U2A.4), U_VrefSch2 (C3B.1 C4B.1 C5B.1 U2B.4), U_VrefSch3 (C3C.1 C4C.1 C5C.1 U2C.4), U_RTDAnalog7 (C1G.2 C2G.1 U1G.6), U_RTDAnalog8 (C1H.2 C2H.1 U1H.6), U_RTDAnalog9 (C1I.2 C2I.1 U1I.6), U_RTDAnalog10 (C1J.2 C2J.1 U1J.6), U_RTDAnalog11 (C1K.2 C2K.1 U1K.6), U_RTDAnalog12 (C1L.2 C2L.1 U1L.6), U_ConnectorSch1 (5 pins), U_ConnectorSch2 (5 pins), U_ConnectorSch3 (5 pins), U_ConnectorSch4 (5 pins), U_ConnectorSch5 (5 pins), U_ConnectorSch6 (5 pins), U_ComparisonSch1 (C6A.2 R9A.1 U3A.1 U3A.4), U_ComparisonSch2 (C6B.2 R9B.1 U3B.1 U3B.4), U_ComparisonSch3 (C6C.2 R9C.1 U3C.1 U3C.4), U_ComparisonSch4 (C6D.2 R9D.1 U3D.1 U3D.4), U_ComparisonSch5 (C6E.2 R9E.1 U3E.1 U3E.4), U_ComparisonSch6 (C6F.2 R9F.1 U3F.1 U3F.4), U_ComparisonSch7 (C6G.2 R9G.1 U3G.1 U3G.4), U_ComparisonSch8 (C6H.2 R9H.1 U3H.1 U3H.4), U_ComparisonSch9 (C6I.2 R9I.1 U3I.1 U3I.4), U_ComparisonSch10 (C6J.2 R9J.1 U3J.1 U3J.4), U_ComparisonSch11 (C6K.2 R9K.1 U3K.1 U3K.4), U_ComparisonSch12 (C6L.2 R9L.1 U3L.1 U3L.4), U_IsolationOut (9 pins), PowerDelivery (5 pins), VccConnSch (J5.2 J5.3 J5.4), Neg12V (15 pins), 12VSupply (27 pins), 5VSupply (27 pins), PowerIsolation (A1.1 C44.1), MonitorOut (J_CF1.13 J_CF1.14 J_CF1.15), U_MonitorOut/U_BufferOutMonL (U5A.4 U9A.4 U10A.4), U_MonitorOut/U_BufferOutMonR (U5B.4 U9B.4 U10B.4), U_ConnectorSch7 (5 pins), U_ConnectorSch8 (5 pins), U_ConnectorSch9 (5 pins), U_ConnectorSch10 (5 pins), U_ConnectorSch11 (5 pins), U_ConnectorSch12 (5 pins), U_ConnGd (9 pins), U_BufferOutR (U5C.4 U9C.4 U10C.4), U_BufferOutL (U5D.4 U9D.4 U10D.4)
CF1: U_ComparisonSch1 (R8A.1 R10A.2 U3A.7), U_IsolationOut (IC1A.3)
CF2: U_ComparisonSch2 (R8B.1 R10B.2 U3B.7), U_IsolationOut (IC1A.4)
CF3: U_ComparisonSch3 (R8C.1 R10C.2 U3C.7), U_IsolationOut (IC1A.5)
CF4: U_ComparisonSch4 (R8D.1 R10D.2 U3D.7), U_IsolationOut (IC1A.6)
CF5: U_ComparisonSch5 (R8E.1 R10E.2 U3E.7), U_IsolationOut (IC2A.3)
CF6: U_ComparisonSch6 (R8F.1 R10F.2 U3F.7), U_IsolationOut (IC2A.4)
CF7: U_ComparisonSch7 (R8G.1 R10G.2 U3G.7), U_IsolationOut (IC2A.5)
CF8: U_ComparisonSch8 (R8H.1 R10H.2 U3H.7), U_IsolationOut (IC2A.6)
CF9: U_ComparisonSch9 (R8I.1 R10I.2 U3I.7), U_IsolationOut (IC3A.3)
CF10: U_ComparisonSch10 (R8J.1 R10J.2 U3J.7), U_IsolationOut (IC3A.4)
CF11: U_ComparisonSch11 (R8K.1 R10K.2 U3K.7), U_IsolationOut (IC3A.5)
CF12: U_ComparisonSch12 (R8L.1 R10L.2 U3L.7), U_IsolationOut (IC3A.6)
CONNGD+1: U_ConnectorSch1 (R28A.2), U_ConnGd (IC1B.3)
CONNGD+2: U_ConnectorSch2 (R28B.2), U_ConnGd (IC1B.4)
CONNGD+3: U_ConnectorSch3 (R28C.2), U_ConnGd (IC1B.5)
CONNGD+4: U_ConnectorSch4 (R28D.2), U_ConnGd (IC1B.6)
CONNGD+5: U_ConnectorSch5 (R28E.2), U_ConnGd (IC2B.3)
CONNGD+6: U_ConnectorSch6 (R28F.2), U_ConnGd (IC2B.4)
CONNGD+7: U_ConnectorSch7 (R28G.2), U_ConnGd (IC2B.5)
CONNGD+8: U_ConnectorSch8 (R28H.2), U_ConnGd (IC2B.6)
CONNGD+9: U_ConnectorSch9 (R28I.2), U_ConnGd (IC3B.3)
CONNGD+10: U_ConnectorSch10 (R28J.2), U_ConnGd (IC3B.4)
CONNGD+11: U_ConnectorSch11 (R28K.2), U_ConnGd (IC3B.5)
CONNGD+12: U_ConnectorSch12 (R28L.2), U_ConnGd (IC3B.6)
NetJ_CF1_1: MonitorOut (J_CF1.1), U_MonitorOut/U_BufferOutMonL (U5A.1 U5A.2)
NetJ_CF1_2: MonitorOut (J_CF1.2), U_MonitorOut/U_BufferOutMonL (U5A.6 U5A.7)
NetJ_CF1_3: MonitorOut (J_CF1.3), U_MonitorOut/U_BufferOutMonL (U9A.1 U9A.2)
NetJ_CF1_4: MonitorOut (J_CF1.4), U_MonitorOut/U_BufferOutMonL (U9A.6 U9A.7)
NetJ_CF1_5: MonitorOut (J_CF1.5), U_MonitorOut/U_BufferOutMonL (U10A.1 U10A.2)
NetJ_CF1_6: MonitorOut (J_CF1.6), U_MonitorOut/U_BufferOutMonL (U10A.6 U10A.7)
NetJ_CF1_7: MonitorOut (J_CF1.7), U_MonitorOut/U_BufferOutMonR (U5B.1 U5B.2)
NetJ_CF1_8: MonitorOut (J_CF1.8), U_MonitorOut/U_BufferOutMonR (U5B.6 U5B.7)
NetJ_CF1_9: MonitorOut (J_CF1.9), U_MonitorOut/U_BufferOutMonR (U9B.1 U9B.2)
NetJ_CF1_10: MonitorOut (J_CF1.10), U_MonitorOut/U_BufferOutMonR (U9B.6 U9B.7)
NetJ_CF1_11: MonitorOut (J_CF1.11), U_MonitorOut/U_BufferOutMonR (U10B.1 U10B.2)
NetJ_CF1_12: MonitorOut (J_CF1.12), U_MonitorOut/U_BufferOutMonR (U10B.6 U10B.7)
NetJ_VTH_1: MainSch (J_VTH.1), U_BufferOutL (U5D.1 U5D.2)
NetJ_VTH_2: MainSch (J_VTH.2), U_BufferOutL (U5D.6 U5D.7)
NetJ_VTH_3: MainSch (J_VTH.3), U_BufferOutL (U9D.1 U9D.2)
NetJ_VTH_4: MainSch (J_VTH.4), U_BufferOutL (U9D.6 U9D.7)
NetJ_VTH_5: MainSch (J_VTH.5), U_BufferOutL (U10D.1 U10D.2)
NetJ_VTH_6: MainSch (J_VTH.6), U_BufferOutL (U10D.6 U10D.7)
NetJ_VTH_7: MainSch (J_VTH.7), U_BufferOutR (U5C.1 U5C.2)
NetJ_VTH_8: MainSch (J_VTH.8), U_BufferOutR (U5C.6 U5C.7)
NetJ_VTH_9: MainSch (J_VTH.9), U_BufferOutR (U9C.1 U9C.2)
NetJ_VTH_10: MainSch (J_VTH.10), U_BufferOutR (U9C.6 U9C.7)
NetJ_VTH_11: MainSch (J_VTH.11), U_BufferOutR (U10C.1 U10C.2)
NetJ_VTH_12: MainSch (J_VTH.12), U_BufferOutR (U10C.6 U10C.7)
NetR15_2: PowerDelivery (R30.2), 12VSupply (R15.2 U4.35)
NetR19_2: PowerDelivery (R24.2), 5VSupply (R19.2 U11.35)
ON/OFF: PowerDelivery (IC4.2), Neg12V (U8.5), 12VSupply (R12.1 R14.2 U4.27), 5VSupply (R11.1 R18.2 U11.27)
RTD+1: U_RTDAnalog1 (R2A.1 U1A.4), U_ConnectorSch1 (J1A.3)
RTD+2: U_RTDAnalog2 (R2B.1 U1B.4), U_ConnectorSch2 (J1B.3)
RTD+3: U_RTDAnalog3 (R2C.1 U1C.4), U_ConnectorSch3 (J1C.3)
RTD+4: U_RTDAnalog4 (R2D.1 U1D.4), U_ConnectorSch4 (J1D.3)
RTD+5: U_RTDAnalog5 (R2E.1 U1E.4), U_ConnectorSch5 (J1E.3)
RTD+6: U_RTDAnalog6 (R2F.1 U1F.4), U_ConnectorSch6 (J1F.3)
RTD+7: U_RTDAnalog7 (R2G.1 U1G.4), U_ConnectorSch7 (J1G.3)
RTD+8: U_RTDAnalog8 (R2H.1 U1H.4), U_ConnectorSch8 (J1H.3)
RTD+9: U_RTDAnalog9 (R2I.1 U1I.4), U_ConnectorSch9 (J1I.3)
RTD+10: U_RTDAnalog10 (R2J.1 U1J.4), U_ConnectorSch10 (J1J.3)
RTD+11: U_RTDAnalog11 (R2K.1 U1K.4), U_ConnectorSch11 (J1K.3)
RTD+12: U_RTDAnalog12 (R2L.1 U1L.4), U_ConnectorSch12 (J1L.3)
RTD-1: U_RTDAnalog1 (R4A.1 R5A.1), U_ConnectorSch1 (J1A.2)
RTD-2: U_RTDAnalog2 (R4B.1 R5B.1), U_ConnectorSch2 (J1B.2)
RTD-3: U_RTDAnalog3 (R4C.1 R5C.1), U_ConnectorSch3 (J1C.2)
RTD-4: U_RTDAnalog4 (R4D.1 R5D.1), U_ConnectorSch4 (J1D.2)
RTD-5: U_RTDAnalog5 (R4E.1 R5E.1), U_ConnectorSch5 (J1E.2)
RTD-6: U_RTDAnalog6 (R4F.1 R5F.1), U_ConnectorSch6 (J1F.2)
RTD-7: U_RTDAnalog7 (R4G.1 R5G.1), U_ConnectorSch7 (J1G.2)
RTD-8: U_RTDAnalog8 (R4H.1 R5H.1), U_ConnectorSch8 (J1H.2)
RTD-9: U_RTDAnalog9 (R4I.1 R5I.1), U_ConnectorSch9 (J1I.2)
RTD-10: U_RTDAnalog10 (R4J.1 R5J.1), U_ConnectorSch10 (J1J.2)
RTD-11: U_RTDAnalog11 (R4K.1 R5K.1), U_ConnectorSch11 (J1K.2)
RTD-12: U_RTDAnalog12 (R4L.1 R5L.1), U_ConnectorSch12 (J1L.2)
Vext: VccConnSch (J5.1), Neg12V (7 pins), 12VSupply (5 pins), 5VSupply (5 pins)
Vref1: U_RTDAnalog1 (R1A.2 R2A.2), U_RTDAnalog2 (R1B.2 R2B.2), U_RTDAnalog3 (R1C.2 R2C.2), U_RTDAnalog4 (R1D.2 R2D.2), U_RTDAnalog5 (R1E.2 R2E.2), U_RTDAnalog6 (R1F.2 R2F.2), U_VrefSch1 (C5A.2 U2A.6)
Vref2: U_VrefSch2 (C5B.2 U2B.6), U_RTDAnalog7 (R1G.2 R2G.2), U_RTDAnalog8 (R1H.2 R2H.2), U_RTDAnalog9 (R1I.2 R2I.2), U_RTDAnalog10 (R1J.2 R2J.2), U_RTDAnalog11 (R1K.2 R2K.2), U_RTDAnalog12 (R1L.2 R2L.2)
Vref3: U_VrefSch3 (C5C.2 U2C.6), U_ComparisonSch1 (R9A.3), U_ComparisonSch2 (R9B.3), U_ComparisonSch3 (R9C.3), U_ComparisonSch4 (R9D.3), U_ComparisonSch5 (R9E.3), U_ComparisonSch6 (R9F.3), U_ComparisonSch7 (R9G.3), U_ComparisonSch8 (R9H.3), U_ComparisonSch9 (R9I.3), U_ComparisonSch10 (R9J.3), U_ComparisonSch11 (R9K.3), U_ComparisonSch12 (R9L.3)
Vrtd1: U_RTDAnalog1 (U1A.7), U_ComparisonSch1 (U3A.3), U_MonitorOut/U_BufferOutMonL (U5A.3)
Vrtd2: U_RTDAnalog2 (U1B.7), U_ComparisonSch2 (U3B.3), U_MonitorOut/U_BufferOutMonL (U5A.5)
Vrtd3: U_RTDAnalog3 (U1C.7), U_ComparisonSch3 (U3C.3), U_MonitorOut/U_BufferOutMonL (U9A.3)
Vrtd4: U_RTDAnalog4 (U1D.7), U_ComparisonSch4 (U3D.3), U_MonitorOut/U_BufferOutMonL (U9A.5)
Vrtd5: U_RTDAnalog5 (U1E.7), U_ComparisonSch5 (U3E.3), U_MonitorOut/U_BufferOutMonL (U10A.3)
Vrtd6: U_RTDAnalog6 (U1F.7), U_ComparisonSch6 (U3F.3), U_MonitorOut/U_BufferOutMonL (U10A.5)
Vrtd7: U_RTDAnalog7 (U1G.7), U_ComparisonSch7 (U3G.3), U_MonitorOut/U_BufferOutMonR (U5B.3)
Vrtd8: U_RTDAnalog8 (U1H.7), U_ComparisonSch8 (U3H.3), U_MonitorOut/U_BufferOutMonR (U5B.5)
Vrtd9: U_RTDAnalog9 (U1I.7), U_ComparisonSch9 (U3I.3), U_MonitorOut/U_BufferOutMonR (U9B.3)
Vrtd10: U_RTDAnalog10 (U1J.7), U_ComparisonSch10 (U3J.3), U_MonitorOut/U_BufferOutMonR (U9B.5)
Vrtd11: U_RTDAnalog11 (U1K.7), U_ComparisonSch11 (U3K.3), U_MonitorOut/U_BufferOutMonR (U10B.3)
Vrtd12: U_RTDAnalog12 (U1L.7), U_ComparisonSch12 (U3L.3), U_MonitorOut/U_BufferOutMonR (U10B.5)
Vthr1: U_ComparisonSch1 (R9A.2 R10A.1 U3A.2), U_BufferOutL (U5D.3)
Vthr2: U_ComparisonSch2 (R9B.2 R10B.1 U3B.2), U_BufferOutL (U5D.5)
Vthr3: U_ComparisonSch3 (R9C.2 R10C.1 U3C.2), U_BufferOutL (U9D.3)
Vthr4: U_ComparisonSch4 (R9D.2 R10D.1 U3D.2), U_BufferOutL (U9D.5)
Vthr5: U_ComparisonSch5 (R9E.2 R10E.1 U3E.2), U_BufferOutL (U10D.3)
Vthr6: U_ComparisonSch6 (R9F.2 R10F.1 U3F.2), U_BufferOutL (U10D.5)
Vthr7: U_ComparisonSch7 (R9G.2 R10G.1 U3G.2), U_BufferOutR (U5C.3)
Vthr8: U_ComparisonSch8 (R9H.2 R10H.1 U3H.2), U_BufferOutR (U5C.5)
Vthr9: U_ComparisonSch9 (R9I.2 R10I.1 U3I.2), U_BufferOutR (U9C.3)
Vthr10: U_ComparisonSch10 (R9J.2 R10J.1 U3J.2), U_BufferOutR (U9C.5)
Vthr11: U_ComparisonSch11 (R9K.2 R10K.1 U3K.2), U_BufferOutR (U10C.3)
Vthr12: U_ComparisonSch12 (R9L.2 R10L.1 U3L.2), U_BufferOutR (U10C.5)